# Altium schematic sheet BlueBox-Amp [CrossOver].SchDoc
size A
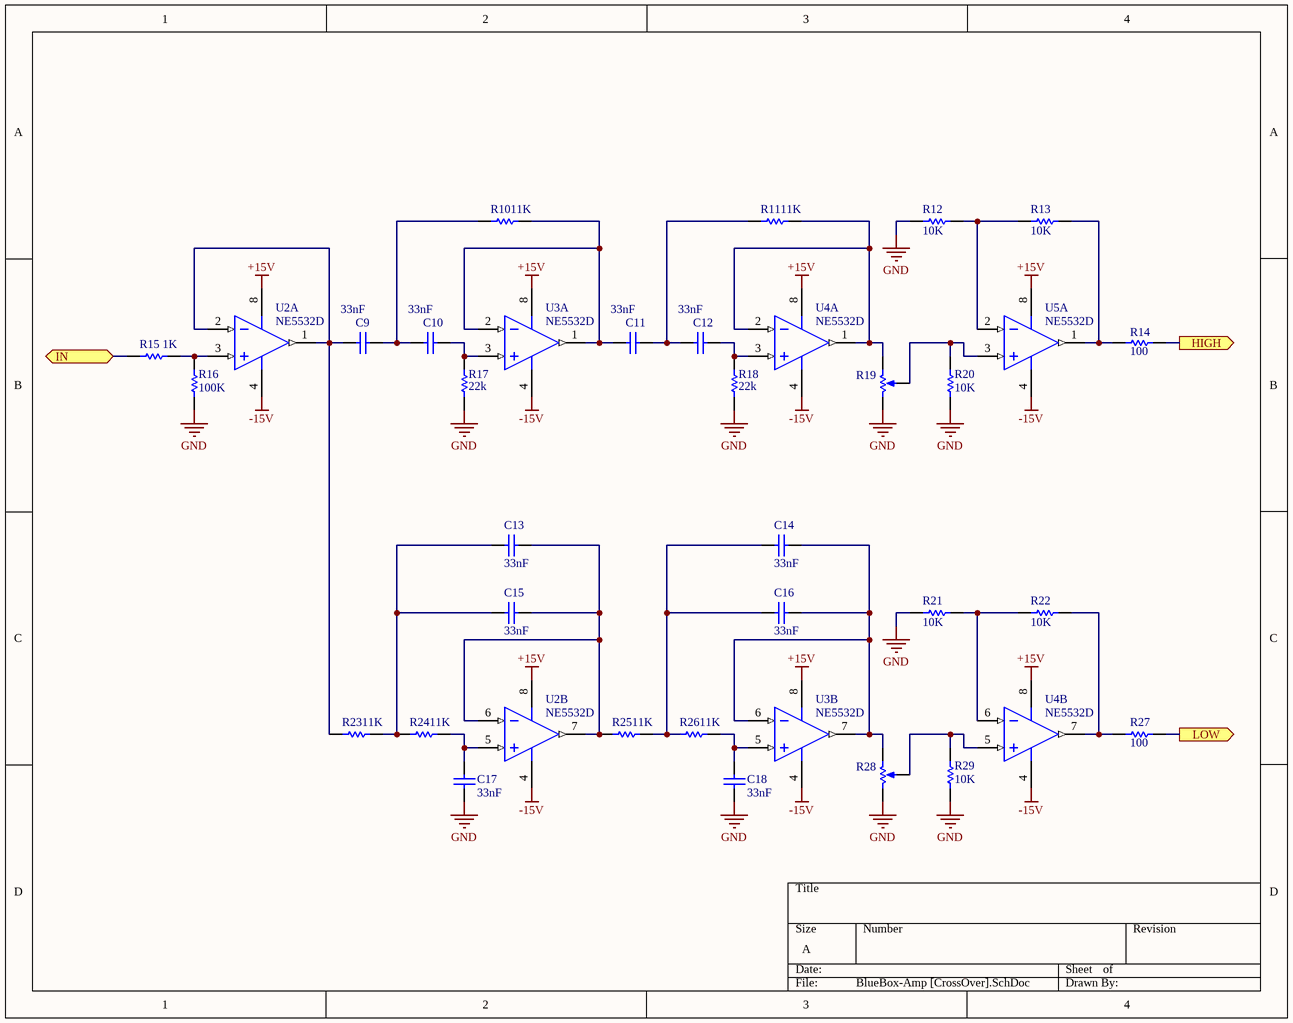
[diagram p0: BlueBox-Amp [CrossOver].SchDoc]

## Parts
C9  value 33nF  [CAPC0603(1608)100_N]  (hidden comment: CAP 33nF 50V 0603(1608))
C10  value 33nF  [CAPC0603(1608)100_N]  (hidden comment: CAP 33nF 50V 0603(1608))
C11  value 33nF  [CAPC0603(1608)100_N]  (hidden comment: CAP 33nF 50V 0603(1608))
C12  value 33nF  [CAPC0603(1608)100_N]  (hidden comment: CAP 33nF 50V 0603(1608))
C13  value 33nF  [CAPC0603(1608)100_N]  (hidden comment: CAP 33nF 50V 0603(1608))
C14  value 33nF  [CAPC0603(1608)100_N]  (hidden comment: CAP 33nF 50V 0603(1608))
C15  value 33nF  [CAPC0603(1608)100_N]  (hidden comment: CAP 33nF 50V 0603(1608))
C16  value 33nF  [CAPC0603(1608)100_N]  (hidden comment: CAP 33nF 50V 0603(1608))
C17  value 33nF  [CAPC0603(1608)100_N]  (hidden comment: CAP 33nF 50V 0603(1608))
C18  value 33nF  [CAPC0603(1608)100_N]  (hidden comment: CAP 33nF 50V 0603(1608))
R10  value 11K  [RESC0603(1608)_M]  (hidden comment: 11K 1% 0603(1608))
R11  value 11K  [RESC0603(1608)_M]  (hidden comment: 11K 1% 0603(1608))
R12  value 10K  [RESC0603(1608)_N]  (hidden comment: 10K 1% 0603(1608))
R13  value 10K  [RESC0603(1608)_N]  (hidden comment: 10K 1% 0603(1608))
R14  value 100  [RESC0603(1608)_M]  (hidden comment: 100R 1% 0603(1608))
R15  value 1K  [RESC0603(1608)_M]  (hidden comment: 1K 1% 0603(1608))
R16  value 100K  [RESC0603(1608)_N]  (hidden comment: 100K 1% 0603(1608))
R17  value 22k  [RESC0603(1608)_L]  (hidden comment: 22K 1% 0603(1608))
R18  value 22k  [RESC0603(1608)_L]  (hidden comment: 22K 1% 0603(1608))
R19  3266W-1-104LF  [BOUR-3266W-3_V]  (value not drawn)
R20  value 10K  [RESC0603(1608)_N]  (hidden comment: 10K 1% 0603(1608))
R21  value 10K  [RESC0603(1608)_N]  (hidden comment: 10K 1% 0603(1608))
R22  value 10K  [RESC0603(1608)_N]  (hidden comment: 10K 1% 0603(1608))
R23  value 11K  [RESC0603(1608)_M]  (hidden comment: 11K 1% 0603(1608))
R24  value 11K  [RESC0603(1608)_M]  (hidden comment: 11K 1% 0603(1608))
R25  value 11K  [RESC0603(1608)_M]  (hidden comment: 11K 1% 0603(1608))
R26  value 11K  [RESC0603(1608)_M]  (hidden comment: 11K 1% 0603(1608))
R27  value 100  [RESC0603(1608)_M]  (hidden comment: 100R 1% 0603(1608))
R28  3266W-1-104LF  [BOUR-3266W-3_V]  (value not drawn)
R29  value 10K  [RESC0603(1608)_N]  (hidden comment: 10K 1% 0603(1608))
U2  NE5532D  [TI-D8_M]  (parts A,B of 2)
U3  NE5532D  [TI-D8_M]  (parts A,B of 2)
U4  NE5532D  [TI-D8_M]  (parts A,B of 2)
U5  NE5532D  [TI-D8_M]  (part A of 2)

## Ports
HIGH, IN, LOW

## Nets
+15V: U2.8(VCC+) U3.8(VCC+) U4.8(VCC+) U5.8(VCC+)
-15V: U2.4(VCC-) U3.4(VCC-) U4.4(VCC-) U5.4(VCC-)
GND: C17.1 C18.1 R12.1 R16.1 R17.1 R18.1 R19.3(CW) R20.2 R21.1 R28.3(CW) R29.2
HIGH: R14.2 ; port HIGH
IN: R15.1 ; port IN
LOW: R27.2 ; port LOW
NetC9_1: C9.1 R23.1 U2.1(OUT1) U2.2(IN1-)
NetC9_2: C9.2 C10.1 R10.1
NetC10_2: C10.2 R17.2 U3.3(IN1+)
NetC11_1: C11.1 R10.2 U3.1(OUT1) U3.2(IN1-)
NetC11_2: C11.2 C12.1 R11.1
NetC12_2: C12.2 R18.2 U4.3(IN1+)
NetC13_1: C13.1 C15.1 R25.1 U2.6(IN2-) U2.7(OUT2)
NetC13_2: C13.2 C15.2 R23.2 R24.1
NetC14_1: C14.1 C16.1 R28.1(CCW) U3.6(IN2-) U3.7(OUT2)
NetC14_2: C14.2 C16.2 R25.2 R26.1
NetC17_2: C17.2 R24.2 U2.5(IN2+)
NetC18_2: C18.2 R26.2 U3.5(IN2+)
NetR11_2: R11.2 R19.1(CCW) U4.1(OUT1) U4.2(IN1-)
NetR12_2: R12.2 R13.1 U5.2(IN1-)
NetR13_2: R13.2 R14.1 U5.1(OUT1)
NetR15_2: R15.2 R16.2 U2.3(IN1+)
NetR19_2: R19.2(WIPER) R20.1 U5.3(IN1+)
NetR21_2: R21.2 R22.1 U4.6(IN2-)
NetR22_2: R22.2 R27.1 U4.7(OUT2)
NetR28_2: R28.2(WIPER) R29.1 U4.5(IN2+)

## Library data of the parts
C9-C18 = CMP-1035-02468-1: CAP 33nF 50V ±5% 0603 (1608 Metric) Thickness 1mm SMD; Case-EIA: 0603; Case-Metric: 1608; Tolerance: ±5%; Max Thickness: 1 mm; Technology: SMT; Rated Voltage: 50 V
R10 R11 R23-R26 = CMP-1012-00627-1: 11K 0.1W 1% 0603 (1608 Metric)  SMD; Case-Metric: 1608; Case-EIA: 0603; Technology: SMT; Power: 0.1 W; Tolerance: 1 %
R12 R13 R20-R22 R29 = CMP-1012-00623-1: 10K 0.1W 1% 0603 (1608 Metric)  SMD; Case-EIA: 0603; Case-Metric: 1608; Power: 0.1 W; Tolerance: 1 %; Technology: SMT
R14 R27 = CMP-1012-00397-1: 100R 0.1W 1% 0603 (1608 Metric)  SMD; Case-EIA: 0603; Case-Metric: 1608; Technology: SMT; Tolerance: 1 %; Power: 0.1 W
R15 = CMP-1012-00510-1: 1K 0.1W 1% 0603 (1608 Metric)  SMD; Case-Metric: 1608; Case-EIA: 0603; Technology: SMT; Tolerance: 1 %; Power: 0.1 W
R16 = CMP-1012-00736-1: 100K 0.1W 1% 0603 (1608 Metric)  SMD; Case-Metric: 1608; Case-EIA: 0603; Power: 0.1 W; Tolerance: 1 %; Technology: SMT
R17 R18 = CMP-1012-00659-1: 22K 0.1W 1% 0603 (1608 Metric)  SMD; Case-EIA: 0603; Case-Metric: 1608; Technology: SMT; Power: 0.1 W; Tolerance: 1 %
R19 R28 = CMP-0975-00021-1: Square Trimpot Trimming Potentiometer, 100 KOhm, 0.25 W, -55 to 125 degC, 3-Pin THD, RoHS, Tube; Manufacturer: Bourns; Power Rating@70 degC: 0.25 W; Tolerance: +/-10%; ComponentLink2URL: https://www.bourns.com/data/global/pdfs/3266.pdf; ComponentLink3Description: Package Specification; ComponentLink1URL: https://www.bourns.com/; ComponentLink2Description: Datasheet; DatasheetVersion: Apr-14; ComponentLink3URL: https://www.bourns.com/data/global/pdfs/3266.pdf; Mounting Technology: Through Hole; Packing: Tube; PackageDescription: 3-Pin THD, Body 6.35 x 4.31 mm, Pitch 2.54 mm; ComponentLink1Description: Manufacturer URL; Operating Temperature: -55 to 125 degC; PartNumber: 3266W-1-104LF; Resistance: 100 kOhm; RoHS: TRUE
U2-U5 = CMP-0015-00060-1: Dual Low-Noise High-Speed Audio Operational Amplifier, 10 to 30 V, 0 to 70 degC, 8-pin SOIC (D8), Green (RoHS & no Sb/Br); Manufacturer: Texas Instruments; Iq per channel(Max)(mA): 4; Total Supply Voltage(Max)(+5V is 5, +/-5V is 10): 30; Vn at 1kHz(Typ)(nV/rtHz): 5; GBW(Typ)(MHz): 10; IIB(Max)(pA): 800000; Sub Family: General Purpose Amplifier, High Supply Voltage Amplifier (>=30V), Low Noise Amp (<=10nV/rtHz); Number of Channels: 2; CMRR(Min)(dB): 70; Slew Rate(Typ)(V/us): 9; ComponentLink1Description: Manufacturer URL; PackageDescription: 8-Pin Plastic Small Outline, Body 4.9 x 3.9 mm, Pitch 1.27 mm; Code_JEDEC: MS-012; Eco-Plan: Green (RoHS & no Sb/Br); ComponentLink3Description: Package Specification; PackageReference: D8; Total Supply Voltage(Min)(+5V is 5, +/-5V is 10): 10; PackageVersion: 4040047-3/M, 06/2011; ComponentLink2Description: Datasheet; PartNumber: NE5532D; ComponentLink2URL: http://www.ti.com/lit/ds/symlink/ne5532.pdf; Mounting Technology: Surface Mount; Vio (25C)(Max)(mV): 4; DatasheetVersion: SLOS075I; ComponentLink3URL: http://www.ti.com/litv/pdf/msoi002j; ComponentLink1URL: http://www.ti.com/; PartId: 1